# Altium schematic sheet MainBoard_MCU.SchDoc: Материнская плата
size 840 x 594 mm; ApprovedBy: Иванов; CheckedBy: Вакулин; DrawnBy: Подлесный; DocumentNumber: VSL.23-MOTHERBOARD; SheetNumber: 1; SheetTotal: 8; DocumentType: Схема электрическая принципиальная; Format: A1; ImagePath: Введите номер платы
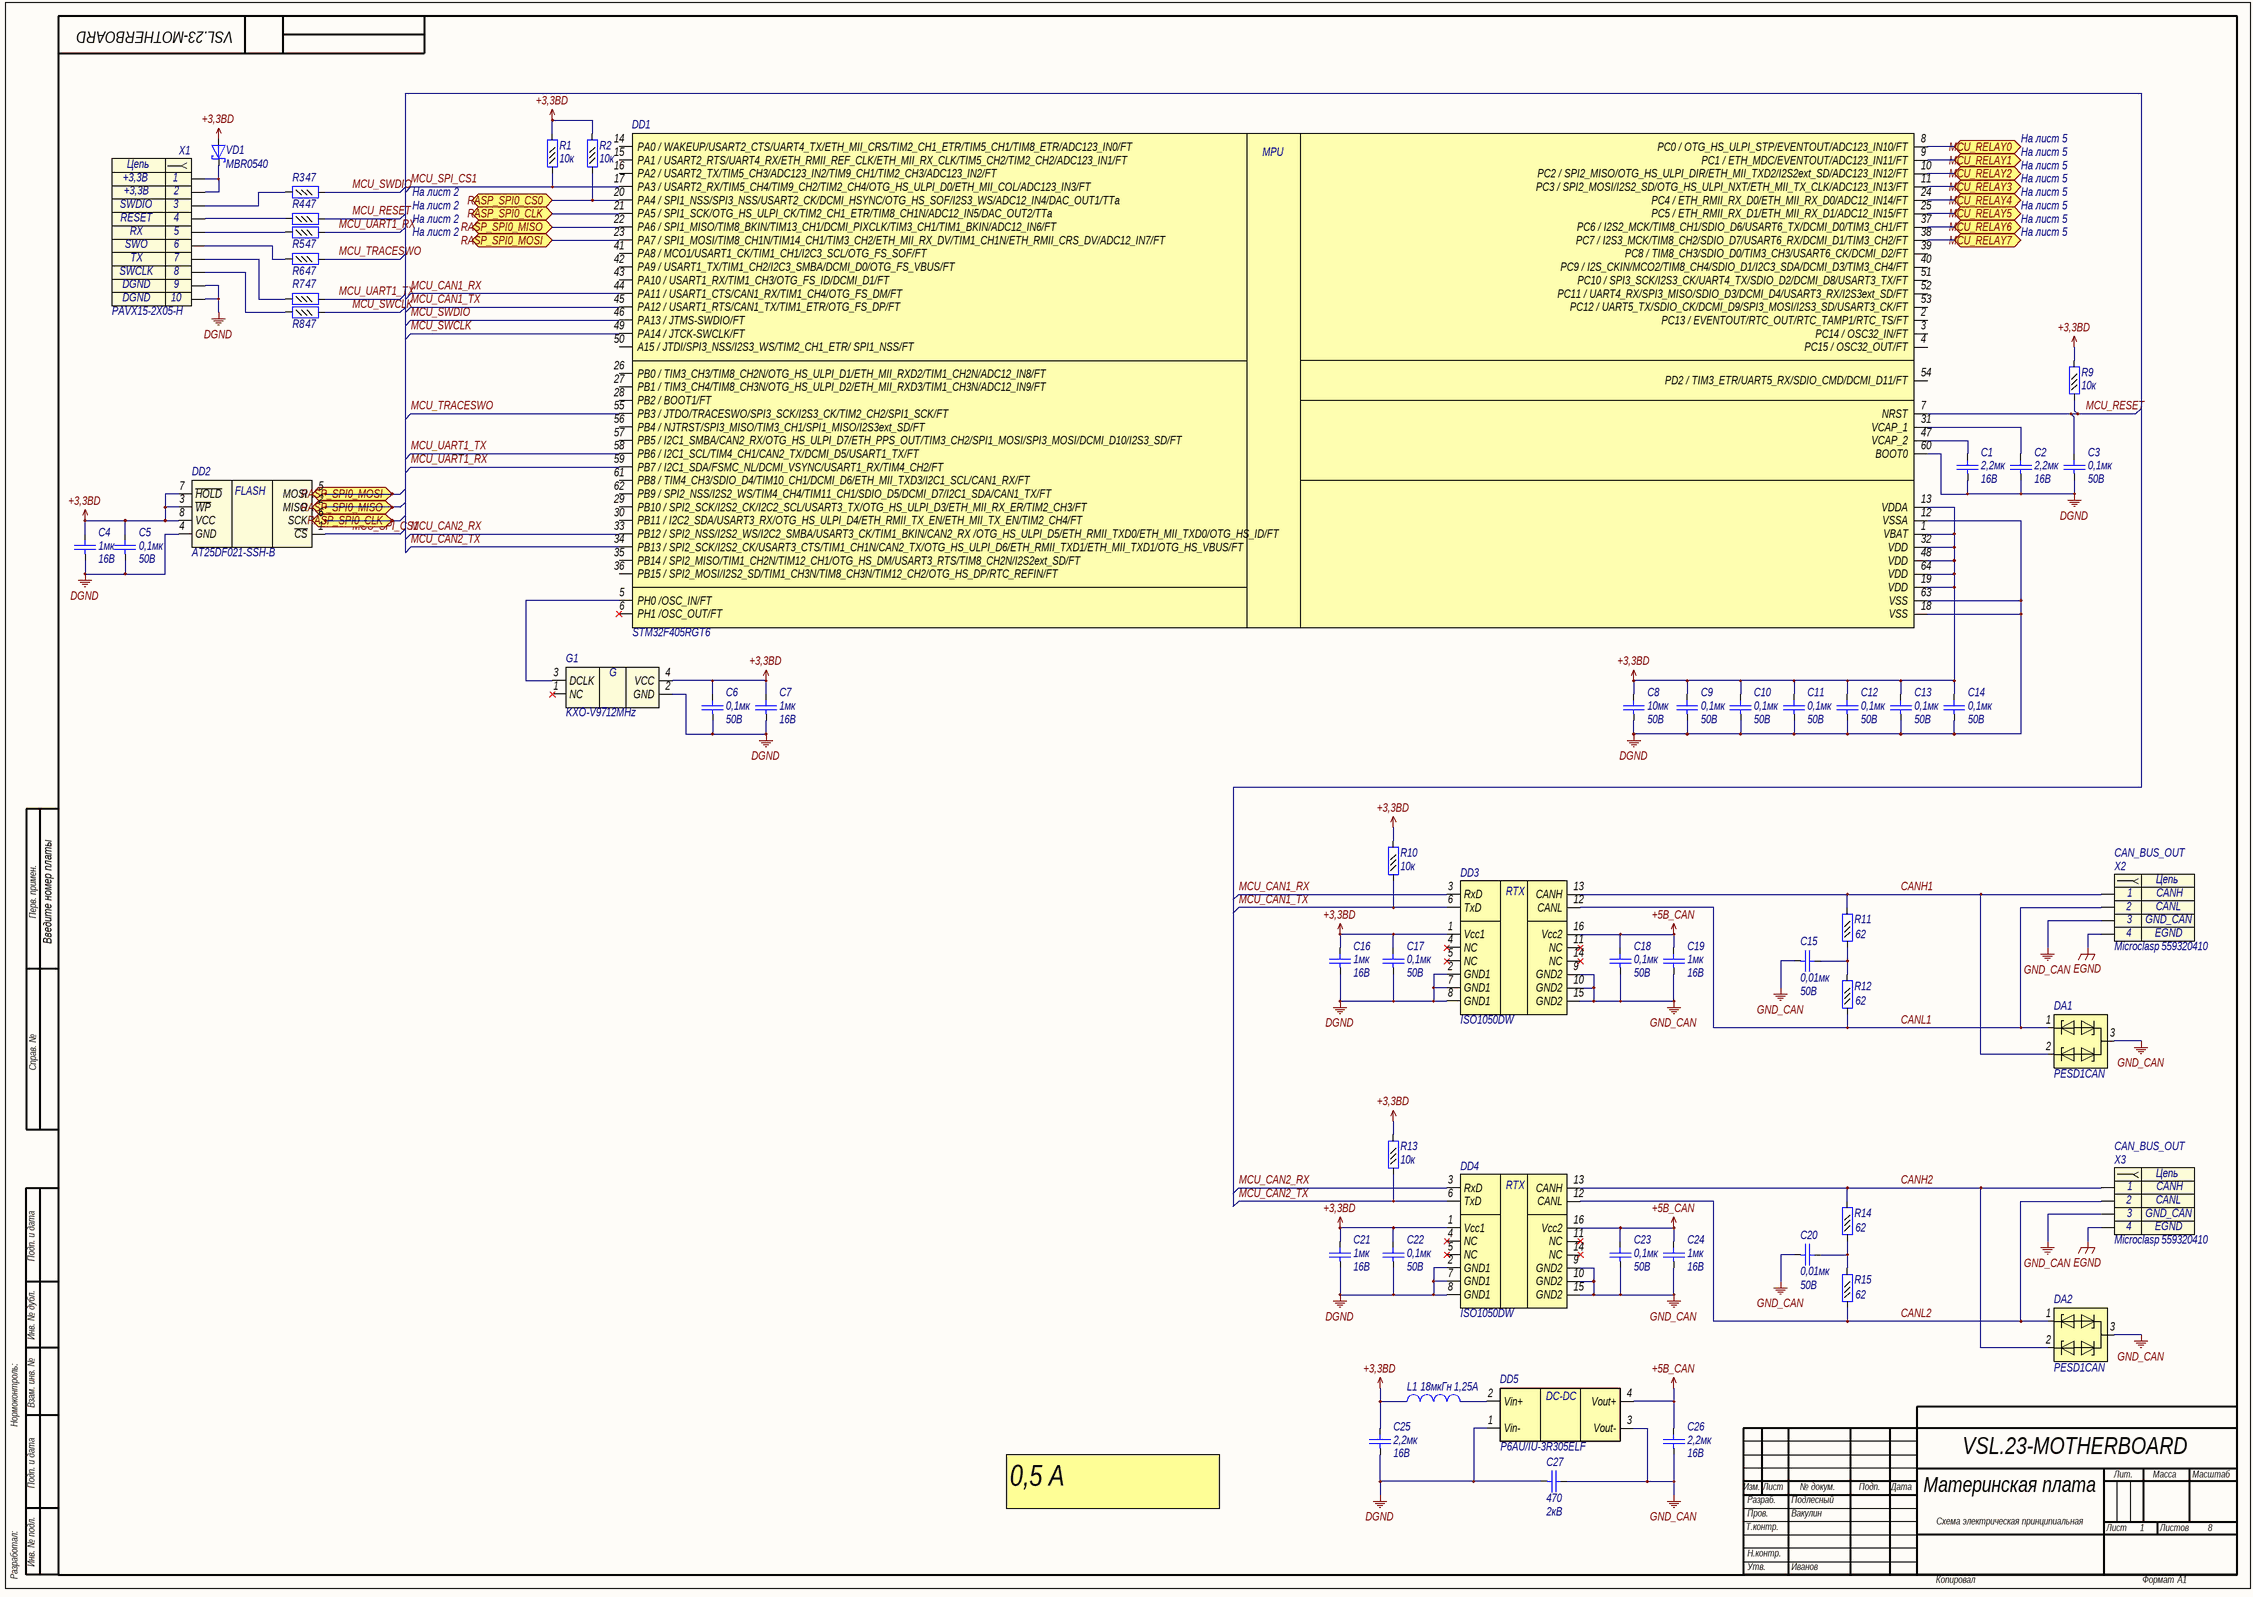
[diagram p0: MainBoard_MCU.SchDoc]

## Parts
C1  Voltage: 16B  [C0603]  (hidden comment: 2,2мк)
C2  Voltage: 16B  [C0603]  (hidden comment: 2,2мк)
C3  value 0,1мк  Voltage: 50В  [C0402]  (hidden comment: Capacitor)
C4  value 1мк  Voltage: 16B  [C0603]  (hidden comment: Capacitor)
C5  value 0,1мк  Voltage: 50В  [C0402]  (hidden comment: Capacitor)
C6  value 0,1мк  Voltage: 50В  [C0402]  (hidden comment: Capacitor)
C7  value 1мк  Voltage: 16B  [C0603]  (hidden comment: Capacitor)
C8  Voltage: 50В  [C1210]  (hidden comment: 10мк)
C9  value 0,1мк  Voltage: 50В  [C0402]  (hidden comment: Capacitor)
C10  value 0,1мк  Voltage: 50В  [C0402]  (hidden comment: Capacitor)
C11  value 0,1мк  Voltage: 50В  [C0402]  (hidden comment: Capacitor)
C12  value 0,1мк  Voltage: 50В  [C0402]  (hidden comment: Capacitor)
C13  value 0,1мк  Voltage: 50В  [C0402]  (hidden comment: Capacitor)
C14  value 0,1мк  Voltage: 50В  [C0402]  (hidden comment: Capacitor)
C15  value 0,01мк  Voltage: 50B  [C0402]  (hidden comment: Capacitor)
C16  value 1мк  Voltage: 16B  [C0603]  (hidden comment: Capacitor)
C17  value 0,1мк  Voltage: 50В  [C0402]  (hidden comment: Capacitor)
C18  value 0,1мк  Voltage: 50В  [C0402]  (hidden comment: Capacitor)
C19  value 1мк  Voltage: 16B  [C0603]  (hidden comment: Capacitor)
C20  value 0,01мк  Voltage: 50B  [C0402]  (hidden comment: Capacitor)
C21  value 1мк  Voltage: 16B  [C0603]  (hidden comment: Capacitor)
C22  value 0,1мк  Voltage: 50В  [C0402]  (hidden comment: Capacitor)
C23  value 0,1мк  Voltage: 50В  [C0402]  (hidden comment: Capacitor)
C24  value 1мк  Voltage: 16B  [C0603]  (hidden comment: Capacitor)
C25  Voltage: 16B  [C0603]  (hidden comment: 2,2мк)
C26  Voltage: 16B  [C0603]  (hidden comment: 2,2мк)
C27  value 470  Voltage: 2кВ  [C1206]  (hidden comment: Capacitor)
DA1  Part Number: PESD1CAN  [SOT23-3]  (hidden comment: PESD)
DA2  Part Number: PESD1CAN  [SOT23-3]  (hidden comment: PESD)
DD1  STM32F405RGT6  [LQFP64]
DD2  Part Number: AT25DF021-SSH-B  [SO8]  (hidden comment: AT25DF021)
DD3  (no value)  [SO16]
DD4  (no value)  [SO16]
DD5  Part Number: P6AU/IU-3R305ELF  [SIP4]  (hidden comment: P6AU-xxxxELF)
G1  Frequence: 12MHz  Part Number: KXO-V97  [QSMD7x5.2x1.8]  (hidden comment: KXO)
L1  value 18мкГн  Rated Current: 1,25A  [SDR0604]  (hidden comment: Inductor)
R1  value 10к  [R0402]  (hidden comment: Resistor_0,062Вт)
R2  value 10к  [R0402]  (hidden comment: Resistor_0,062Вт)
R3  value 47  [R0402]  (hidden comment: Resistor_0,062Вт)
R4  value 47  [R0402]  (hidden comment: Resistor_0,062Вт)
R5  value 47  [R0402]  (hidden comment: Resistor_0,062Вт)
R6  value 47  [R0402]  (hidden comment: Resistor_0,062Вт)
R7  value 47  [R0402]  (hidden comment: Resistor_0,062Вт)
R8  value 47  [R0402]  (hidden comment: Resistor_0,062Вт)
R9  value 10к  [R0402]  (hidden comment: Resistor_0,062Вт)
R10  value 10к  [R0402]  (hidden comment: Resistor_0,062Вт)
R11  value 62  [R0402]  (hidden comment: Resistor_0,062Вт)
R12  value 62  [R0402]  (hidden comment: Resistor_0,062Вт)
R13  value 10к  [R0402]  (hidden comment: Resistor_0,062Вт)
R14  value 62  [R0402]  (hidden comment: Resistor_0,062Вт)
R15  value 62  [R0402]  (hidden comment: Resistor_0,062Вт)
VD1  Part Number: MBR0540  [SOD-123]  (hidden comment: DiodeSchottky)
X1  Header_10_sct  [PAVX15-2X05-H]  (value not drawn)
X2  CAN_BUS_OUT  Part Number: 559320410  [MOLEX_559320410]
X3  CAN_BUS_OUT  Part Number: 559320410  [MOLEX_559320410]

## Ports
MCU_RELAY0, MCU_RELAY1, MCU_RELAY2, MCU_RELAY3, MCU_RELAY4, MCU_RELAY5, MCU_RELAY6, MCU_RELAY7, RASP_SPI0_CLK, RASP_SPI0_CS0, RASP_SPI0_MISO, RASP_SPI0_MOSI

## Nets
+3,3BD: C4.2 C5.2 C6.2 C7.2 C8.2 C9.2 C10.2 C11.2 C12.2 C13.2 C14.2 C16.2 C17.2 C21.2 C22.2 C25.2 DD1.1(VBAT) DD1.13(VDDA) DD1.19(VDD) DD1.32(VDD) DD1.48(VDD) DD1.64(VDD) DD2.3(~{WP}) DD2.7(~{HOLD}) DD2.8(VCC) DD3.1(Vcc1) DD4.1(Vcc1) G1.4(VCC) L1.1 R1.2 R2.2 R9.2 R10.2 R13.2 VD1.2(A)
+5B_CAN: C18.2 C19.2 C23.2 C24.2 C26.2 DD3.16(Vcc2) DD4.16(Vcc2) DD5.4(Vout+)
DGND: C1.1 C2.1 C3.1 C4.1 C5.1 C6.1 C7.1 C8.1 C9.1 C10.1 C11.1 C12.1 C13.1 C14.1 C16.1 C17.1 C21.1 C22.1 C25.1 C27.1 DD1.12(VSSA) DD1.18(VSS) DD1.60(BOOT0) DD1.63(VSS) DD2.4(GND) DD3.2(GND1) DD3.7(GND1) DD3.8(GND1) DD4.2(GND1) DD4.7(GND1) DD4.8(GND1) DD5.1(Vin-) G1.2(GND) X1.9 X1.10
EGND: X2.4 X3.4
GND_CAN: C15.1 C18.1 C19.1 C20.1 C23.1 C24.1 C26.1 C27.2 DA1.3 DA2.3 DD3.9(GND2) DD3.10(GND2) DD3.15(GND2) DD4.9(GND2) DD4.10(GND2) DD4.15(GND2) DD5.3(Vout-) X2.3 X3.3
CANH1: DA1.2 DD3.13(CANH) R11.2 X2.1
CANH2: DA2.2 DD4.13(CANH) R14.2 X3.1
CANL1: DA1.1 DD3.12(CANL) R12.1 X2.2
CANL2: DA2.1 DD4.12(CANL) R15.1 X3.2
MCU_CAN1_RX: DD1.44(PA11_/_USART1_CTS/CAN1_RX/TIM1_CH4/OTG_FS_DM/FT) DD3.3(RxD)
MCU_CAN1_TX: DD1.45(PA12_/_USART1_RTS/CAN1_TX/TIM1_ETR/OTG_FS_DP/FT) DD3.6(TxD) R10.1
MCU_CAN2_RX: DD1.33(PB12_/_SPI2_NSS/I2S2_WS/I2C2_SMBA/USART3_CK/TIM1_BKIN/CAN2_RX_/OTG_HS_ULPI_D5/ETH_RMII_TXD0/ETH_MII_TXD0/OTG_HS_ID/FT) DD4.3(RxD)
MCU_CAN2_TX: DD1.34(PB13_/_SPI2_SCK/I2S2_CK/USART3_CTS/TIM1_CH1N/CAN2_TX/OTG_HS_ULPI_D6/ETH_RMII_TXD1/ETH_MII_TXD1/OTG_HS_VBUS/FT) DD4.6(TxD) R13.1
MCU_RELAY0: DD1.8(PC0_/_OTG_HS_ULPI_STP/EVENTOUT/ADC123_IN10/FT) ; port MCU_RELAY0
MCU_RELAY1: DD1.9(PC1_/_ETH_MDC/EVENTOUT/ADC123_IN11/FT) ; port MCU_RELAY1
MCU_RELAY2: DD1.10(PC2_/_SPI2_MISO/OTG_HS_ULPI_DIR/ETH_MII_TXD2/I2S2ext_SD/ADC123_IN12/FT) ; port MCU_RELAY2
MCU_RELAY3: DD1.11(PC3_/_SPI2_MOSI/I2S2_SD/OTG_HS_ULPI_NXT/ETH_MII_TX_CLK/ADC123_IN13/FT) ; port MCU_RELAY3
MCU_RELAY4: DD1.24(PC4_/_ETH_RMII_RX_D0/ETH_MII_RX_D0/ADC12_IN14/FT) ; port MCU_RELAY4
MCU_RELAY5: DD1.25(PC5_/_ETH_RMII_RX_D1/ETH_MII_RX_D1/ADC12_IN15/FT) ; port MCU_RELAY5
MCU_RELAY6: DD1.37(PC6_/_I2S2_MCK/TIM8_CH1/SDIO_D6/USART6_TX/DCMI_D0/TIM3_CH1/FT) ; port MCU_RELAY6
MCU_RELAY7: DD1.38(PC7_/_I2S3_MCK/TIM8_CH2/SDIO_D7/USART6_RX/DCMI_D1/TIM3_CH2/FT) ; port MCU_RELAY7
MCU_RESET: C3.2 DD1.7(NRST) R4.2 R9.1
MCU_SPI_CS1: DD1.17(PA3_/_USART2_RX/TIM5_CH4/TIM9_CH2/TIM2_CH4/OTG_HS_ULPI_D0/ETH_MII_COL/ADC123_IN3/FT) DD2.1(~{CS}) R1.1
MCU_SWCLK: DD1.49(PA14_/_JTCK-SWCLK/FT) R8.2
MCU_SWDIO: DD1.46(PA13_/_JTMS-SWDIO/FT) R3.2
MCU_TRACESWO: DD1.55(PB3_/_JTDO/TRACESWO/SPI3_SCK/I2S3_CK/TIM2_CH2/SPI1_SCK/FT) R6.2
MCU_UART1_RX: DD1.59(PB7_/_I2C1_SDA/FSMC_NL/DCMI_VSYNC/USART1_RX/TIM4_CH2/FT) R5.2
MCU_UART1_TX: DD1.58(PB6_/_I2C1_SCL/TIM4_CH1/CAN2_TX/DCMI_D5/USART1_TX/FT) R7.2
RASP_SPI0_CLK: DD1.21(PA5_/_SPI1_SCK/OTG_HS_ULPI_CK/TIM2_CH1_ETR/TIM8_CH1N/ADC12_IN5/DAC_OUT2/TTa) DD2.6(SCK) ; port RASP_SPI0_CLK
RASP_SPI0_CS0: DD1.20(PA4_/_SPI1_NSS/SPI3_NSS/USART2_CK/DCMI_HSYNC/OTG_HS_SOF/I2S3_WS/ADC12_IN4/DAC_OUT1/TTa) R2.1 ; port RASP_SPI0_CS0
RASP_SPI0_MISO: DD1.22(PA6_/_SPI1_MISO/TIM8_BKIN/TIM13_CH1/DCMI_PIXCLK/TIM3_CH1/TIM1_BKIN/ADC12_IN6/FT) DD2.2(MISO) ; port RASP_SPI0_MISO
RASP_SPI0_MOSI: DD1.23(PA7_/_SPI1_MOSI/TIM8_CH1N/TIM14_CH1/TIM3_CH2/ETH_MII_RX_DV/TIM1_CH1N/ETH_RMII_CRS_DV/ADC12_IN7/FT) DD2.5(MOSI) ; port RASP_SPI0_MOSI
NetC1_2: C1.2 DD1.47(VCAP_2)
NetC2_2: C2.2 DD1.31(VCAP_1)
NetC15_2: C15.2 R11.1 R12.2
NetC20_2: C20.2 R14.1 R15.2
NetDD1_5: DD1.5(PH0_/OSC_IN/FT) G1.3(DCLK)
NetDD5_2: DD5.2(Vin+) L1.2
NetR3_1: R3.1 X1.3
NetR4_1: R4.1 X1.4
NetR5_1: R5.1 X1.5
NetR6_1: R6.1 X1.6
NetR7_1: R7.1 X1.7
NetR8_1: R8.1 X1.8
NetVD1_1: VD1.1(K) X1.1 X1.2

Not connected (* = marked no-connect by the designer): DD1 2(PC13_/_EVENTOUT/RTC_OUT/RTC_TAMP1/RTC_TS/FT) 3(PC14_/_OSC32_IN/FT) 4(PC15_/_OSC32_OUT/FT) 6(PH1_/OSC_OUT/FT)* 14(PA0_/_WAKEUP/USART2_CTS/UART4_TX/ETH_MII_CRS/TIM2_CH1_ETR/TIM5_CH1/TIM8_ETR/ADC123_IN0/FT) 15(PA1_/_USART2_RTS/UART4_RX/ETH_RMII_REF_CLK/ETH_MII_RX_CLK/TIM5_CH2/TIM2_CH2/ADC123_IN1/FT) 16(PA2_/_USART2_TX/TIM5_CH3/ADC123_IN2/TIM9_CH1/TIM2_CH3/ADC123_IN2/FT) 26(PB0_/_TIM3_CH3/TIM8_CH2N/OTG_HS_ULPI_D1/ETH_MII_RXD2/TIM1_CH2N/ADC12_IN8/FT) 27(PB1_/_TIM3_CH4/TIM8_CH3N/OTG_HS_ULPI_D2/ETH_MII_RXD3/TIM1_CH3N/ADC12_IN9/FT) 28(PB2_/_BOOT1/FT) 29(PB10_/_SPI2_SCK/I2S2_CK/I2C2_SCL/USART3_TX/OTG_HS_ULPI_D3/ETH_MII_RX_ER/TIM2_CH3/FT) 30(PB11_/_I2C2_SDA/USART3_RX/OTG_HS_ULPI_D4/ETH_RMII_TX_EN/ETH_MII_TX_EN/TIM2_CH4/FT) 35(PB14_/_SPI2_MISO/TIM1_CH2N/TIM12_CH1/OTG_HS_DM/USART3_RTS/TIM8_CH2N/I2S2ext_SD/FT) 36(PB15_/_SPI2_MOSI/I2S2_SD/TIM1_CH3N/TIM8_CH3N/TIM12_CH2/OTG_HS_DP/RTC_REFIN/FT) 39(PC8_/_TIM8_CH3/SDIO_D0/TIM3_CH3/USART6_CK/DCMI_D2/FT) 40(PC9_/_I2S_CKIN/MCO2/TIM8_CH4/SDIO_D1/I2C3_SDA/DCMI_D3/TIM3_CH4/FT) 41(PA8_/_MCO1/USART1_CK/TIM1_CH1/I2C3_SCL/OTG_FS_SOF/FT) 42(PA9_/_USART1_TX/TIM1_CH2/I2C3_SMBA/DCMI_D0/OTG_FS_VBUS/FT) 43(PA10_/_USART1_RX/TIM1_CH3/OTG_FS_ID/DCMI_D1/FT) 50(A15_/_JTDI/SPI3_NSS/I2S3_WS/TIM2_CH1_ETR/_SPI1_NSS/FT) 51(PC10_/_SPI3_SCK/I2S3_CK/UART4_TX/SDIO_D2/DCMI_D8/USART3_TX/FT) 52(PC11_/_UART4_RX/SPI3_MISO/SDIO_D3/DCMI_D4/USART3_RX/I2S3ext_SD/FT) 53(PC12_/_UART5_TX/SDIO_CK/DCMI_D9/SPI3_MOSI/I2S3_SD/USART3_CK/FT) 54(PD2_/_TIM3_ETR/UART5_RX/SDIO_CMD/DCMI_D11/FT) 56(PB4_/_NJTRST/SPI3_MISO/TIM3_CH1/SPI1_MISO/I2S3ext_SD/FT) 57(PB5_/_I2C1_SMBA/CAN2_RX/OTG_HS_ULPI_D7/ETH_PPS_OUT/TIM3_CH2/SPI1_MOSI/SPI3_MOSI/DCMI_D10/I2S3_SD/FT) 61(PB8_/_TIM4_CH3/SDIO_D4/TIM10_CH1/DCMI_D6/ETH_MII_TXD3/I2C1_SCL/CAN1_RX/FT) 62(PB9_/_SPI2_NSS/I2S2_WS/TIM4_CH4/TIM11_CH1/SDIO_D5/DCMI_D7/I2C1_SDA/CAN1_TX/FT); DD3 4(NC)* 5(NC)* 11(NC)* 14(NC)*; DD4 4(NC)* 5(NC)* 11(NC)* 14(NC)*; G1 1(NC)*

## Notes on the sheet
- На лист 5
- На лист 2
- Перв. примен.
- (near X2) Microclasp
- Справ. №
- Подп. и дата
- (near X3) Microclasp
- Инв. № дубл.
- Нормоконтроль:
- Взам. инв. №
- Изм.
- Лист
- № докум.
- Подп.
- Дата
- Лит.
- Масса
- Масштаб
- 0,5 А
- Т.контр.
- Пров.
- Разраб.
- Листов
- Разработал:
- Инв. № подл.
- Н.контр.
- Утв.
- Копировал
- Формат
- (in symbol AT25DF021-SSH-B) FLASH
- (in symbol connect97) Цепь
- (in symbol connect107) Цепь
- (in symbol crystal10) G
- (in symbol interf22) RTX
- (in symbol microcont10) MPU
- (in symbol pwr54) DC-DC

## Library data of the parts
C1 C2 C25 C26 = cap287: Конденсатор; Part Name: Ceramic; Manufacture: Murata; Part Number: GRM188Z71C225ME43J; id: cap287; TKE: X7R; tga: 0,10%; Value: 2,2мк
C3 C5 C6 C9-C14 C17 C18 C22 C23 = cap277: Конденсатор; Part Name: Ceramic; Manufacture: Murata; Part Number: GRM155R71H104KE14D; id: cap277; TKE: X7R; tga: 0,10%
C4 C7 C16 C19 C21 C24 = cap133: Конденсатор; Part Name: Ceramic; Manufacture: Murata; Part Number: GRM188R71C105KA12D**; id: cap133; TKE: X7R
C8 = cap297: Конденсатор; Part Name: MLCC; Manufacture: TDK; Part Number: C3225X7R1H106K250AC; id: cap297; TKE: X7R; tga: 0,10%; Value: 10мк
C15 C20 = cap42: Конденсатор; Part Name: Ceramic; Manufacture: Murata; Part Number: GRM155R71H103K; id: cap42; TKE: X7R
C27 = cap284: Конденсатор; Part Name: Ceramic; Manufacture: Yageo; Part Number: CC1206KKX7RDBB471; id: cap284; TKE: X7R
DA1 DA2 = PESD1CAN: TVS; Part Name: CAN bus ESD protection diode; Manufacture: Nexperia; id: esd5; Max Reverse Voltage: 24B; Breakdown Voltage: 25,4B; Capacitance: 17pF; Number of Channels: 2
DD1 = microcont10: Part Name: Microcontroller; Frequency: 168MHz; ADC: 16x12b/2x12b; Interface: can, i2c, irda, lin, spi, uart, usbotg,sdio; Flash: 1Mb; Pin in: 51; Power Supply: 1.8-3.6V; id: microcont10; Part Number: STM32F405RGT6
DD2 = AT25DF021-SSH-B: SPI Serial Flash  Memory; Manufacturer: Adesto; id: mem1; Memory Size: 2Mbit; Power Supply: 2.7-3.6 V; Part Name: Flash; Interface: spi
DD3 DD4 = interf22: Isolated CAN Transceiver; Manufacture: Texas Instruments; Number of Channel: 1; Type Supply: Single Polar; Current Consumption: 76mA; Power Supply: 3-5,5В/4,75-5,25В; id: interf22; Part Name: Isolated CAN Transceiver; Part Number: ISO1050DW
DD5 = pwr54: DC/DC преобразователь; Part Name: DC/DC Converter Isolated; Manufacturer: PEAK Electronics; id: pwr54; Input Voltage: 3,3B; Output Voltage: 5B; Current: 200mA; Type: Isolated
G1 = crystal10: Кварц. генер. 32.768 МГц (HCMOS/TTL); Manufacture: GEYER; id: crystal10
L1 = ind45: EMI Suppression Filter; Part Name: SMD Power Inductors; Part Number: SDR0604- 180YL; Manufacture: Bourns; id: ind45; Saturation Current: 1,5A; Resistance: 0,15Ohm
R1 R2 R9 R10 R13 = res294: Резистор; Manufacture: Yageo; Part Number: RC0402FR-0710KL; id: res294; Accuracy: 0,01; Part Name: Resistor; Power: 0,062Вт
R3-R8 = res238: Резистор; Manufacture: Yageo; Part Number: RC0402FR-0747RL; id: res238; Accuracy: 0,01; Part Name: Resistor; Power: 0,062Вт
R11 R12 R14 R15 = res241: Резистор; Manufacture: Yageo; Part Number: RC0402FR-0762RL; id: res241; Accuracy: 0,01; Part Name: Resistor; Power: 0,062Вт
VD1 = diode15: Диод Шоттки; Manufacture: ON Semiconductor; Max Reverse Voltage: 40B; Forward Voltage: 0,62B; Forward Current: 0,5А; Capacitance: 30pF; Number of Channels: 1; id: diode15; Part Name: Diode Schottky
X1 = connect107: Разъем - 10 конт. розетка; Part Name: Штыри двухрядные 2x5; Manufacture: Auk Contractors; Contact_1: +3,3B; Contact_3: SWDIO; Contact_4: RESET; Contact_5: RX; Contact_6: SWO; Etch: 1.27mm; Contact_7: TX; Contact_8: SWCLK; Contact_9: DGND; Contact_2: +3,3B; id: connect107; Part Number: PAVX15-2X05-H; Contact_10: DGND
X2 X3 = connect97: Разъем - 4 конт. розетка; Part Name: MicroClasp Wire-to-Board Header; Manufacture: Molex; Contact_1: CANH; Contact_2: CANL; Contact_3: GND_CAN; Contact_4: EGND; Etch: 2mm; id: connect97